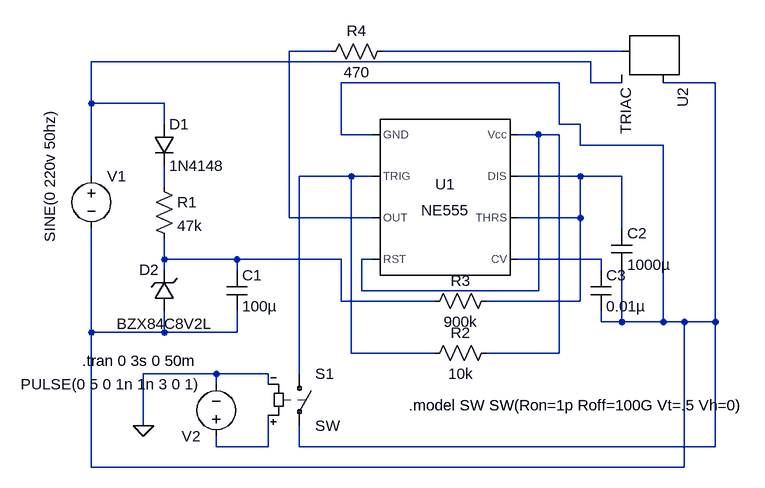
[diagram p0: schematic Draft1.asc]
Draft1.asc, the LTspice schematic file:
Version 4
SHEET 1 1048 680
WIRE 368 -64 304 -64
WIRE 816 -64 448 -64
WIRE 768 -48 0 -48
WIRE 720 -16 384 -16
WIRE 768 -16 768 -48
WIRE 816 -16 768 -16
WIRE 960 -16 880 -16
WIRE 0 16 0 -48
WIRE 112 16 0 16
WIRE 112 48 112 16
WIRE 720 48 720 -16
WIRE 752 48 720 48
WIRE 384 64 384 -16
WIRE 432 64 384 64
WIRE 688 64 656 64
WIRE 720 64 688 64
WIRE 752 80 752 48
WIRE 880 80 752 80
WIRE 0 128 0 16
WIRE 400 128 320 128
WIRE 432 128 400 128
WIRE 752 128 656 128
WIRE 816 128 752 128
WIRE 112 144 112 112
WIRE 304 192 304 -64
WIRE 432 192 304 192
WIRE 752 192 752 128
WIRE 752 192 656 192
WIRE 816 208 816 128
WIRE 112 256 112 224
WIRE 224 256 112 256
WIRE 384 256 224 256
WIRE 432 256 416 256
WIRE 784 256 656 256
WIRE 112 272 112 256
WIRE 224 272 224 256
WIRE 784 272 784 256
WIRE 416 304 416 256
WIRE 688 304 688 64
WIRE 688 304 416 304
WIRE 384 320 384 256
WIRE 528 320 384 320
WIRE 752 320 752 192
WIRE 752 320 608 320
WIRE 784 352 784 336
WIRE 816 352 816 272
WIRE 816 352 784 352
WIRE 880 352 880 80
WIRE 880 352 816 352
WIRE 912 352 880 352
WIRE 960 352 960 -16
WIRE 960 352 912 352
WIRE 0 368 0 208
WIRE 112 368 112 336
WIRE 112 368 0 368
WIRE 224 368 224 336
WIRE 224 368 112 368
WIRE 400 400 400 128
WIRE 528 400 400 400
WIRE 720 400 720 64
WIRE 720 400 608 400
WIRE 192 432 80 432
WIRE 272 432 192 432
WIRE 320 432 320 128
WIRE 192 448 192 432
WIRE 272 448 272 432
WIRE 80 512 80 432
WIRE 192 544 192 528
WIRE 272 544 272 496
WIRE 272 544 192 544
WIRE 320 544 320 512
WIRE 960 544 960 352
WIRE 960 544 320 544
WIRE 0 576 0 368
WIRE 912 576 912 352
WIRE 912 576 0 576
FLAG 80 512 0
SYMBOL diode 96 48 R0
SYMATTR InstName D1
SYMATTR Value 1N4148
SYMBOL zener 128 336 R180
WINDOW 0 24 64 Left 2
WINDOW 3 -58 -19 Left 2
SYMATTR InstName D2
SYMATTR Value BZX84C8V2L
SYMBOL res 96 128 R0
SYMATTR InstName R1
SYMATTR Value 47k
SYMATTR SpiceLine pwr=5w
SYMBOL cap 208 272 R0
SYMATTR InstName C1
SYMATTR Value 100µ
SYMATTR SpiceLine V=12
SYMBOL voltage 0 112 R0
WINDOW 3 -64 -86 VRight 2
SYMATTR InstName V1
SYMATTR Value SINE(0 220v 50hz)
SYMBOL Misc\\NE555 544 160 R0
SYMATTR InstName U1
SYMBOL cap 800 208 R0
SYMATTR InstName C2
SYMATTR Value 1000µ
SYMBOL res 624 304 R90
WINDOW 0 0 56 VBottom 2
WINDOW 3 32 56 VTop 2
SYMATTR InstName R3
SYMATTR Value 900k
SYMBOL res 624 384 R90
WINDOW 0 0 56 VBottom 2
WINDOW 3 32 56 VTop 2
SYMATTR InstName R2
SYMATTR Value 10k
SYMBOL Misc\\TRIAC 880 -48 R90
SYMATTR InstName U2
SYMBOL cap 768 272 R0
SYMATTR InstName C3
SYMATTR Value 0.01µ
SYMBOL res 464 -80 R90
WINDOW 0 0 56 VBottom 2
WINDOW 3 32 56 VTop 2
SYMATTR InstName R4
SYMATTR Value 470
SYMBOL sw 320 416 R0
SYMATTR InstName S1
SYMBOL voltage 192 544 R180
WINDOW 123 0 0 Left 0
WINDOW 39 0 0 Left 0
SYMATTR InstName V2
SYMATTR Value PULSE(0 5 0 1n 1n 3 0 1)
TEXT -14 412 Left 2 !.tran 0 3s 0 50m
TEXT 488 480 Left 2 !.model SW SW(Ron=1p Roff=100G Vt=.5 Vh=0)

The netlist it stands for:
* Draft1.asc
D1 N003 N008 1N4148
D2 N004 N009 BZX84C8V2L
R1 N008 N009 47k pwr=5w
C1 N009 N004 100µ V=12
V1 N003 N004 SINE(0 220v 50hz)
XU1 N004 N006 N001 N005 N010 N007 N007 N005 NE555  ; pins GND TRIG OUT RST CV THRS DIS Vcc
C2 N007 N004 1000µ
R3 N007 N009 900k
R2 N005 N006 10k
XU2 N004 N002 N003 TRIAC  ; pins MT2 G MT1
C3 N010 N004 0.01µ
R4 N002 N001 470
S1 N006 N004 N011 0 SW
V2 N011 0 PULSE(0 5 0 1n 1n 3 0 1)
.model D D
.lib standard.dio
.tran 0 3s 0 50m
.model SW SW(Ron=1p Roff=100G Vt=.5 Vh=0)
.lib NE555.sub
.backanno
.end